# Altium schematic sheet P09-USB_JTAG.SchDoc
size 513 x 386 mm
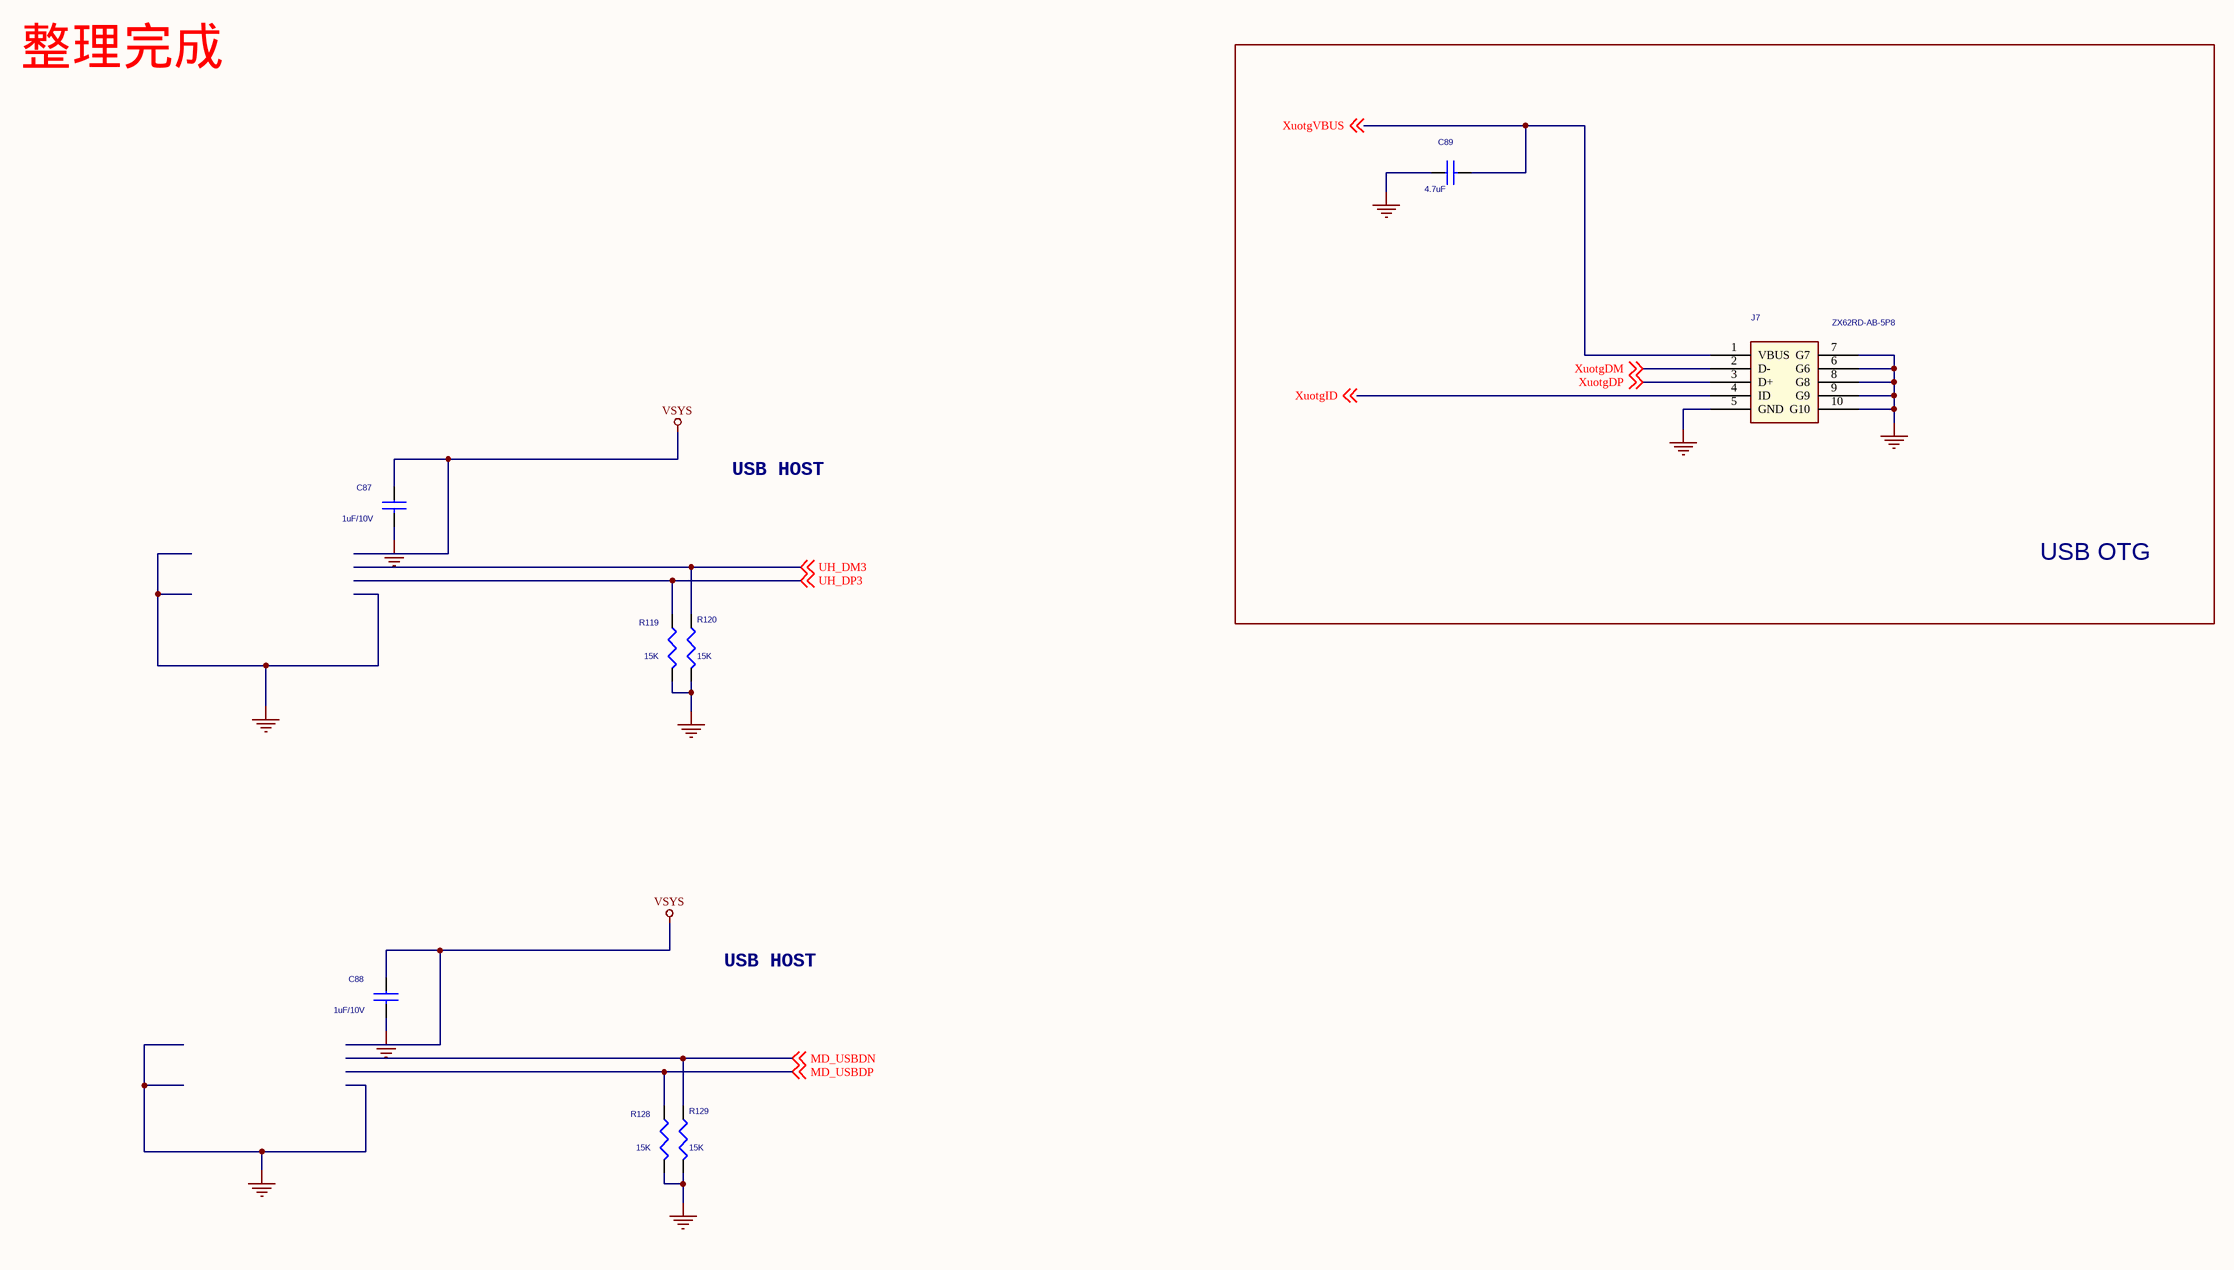
[diagram p0: P09-USB_JTAG.SchDoc]

## Parts
C87  1uF/10V  [C0603-S]
C88  1uF/10V  [C0603-S]
C89  4.7uF  [C0603-S]
J7  ZX62RD-AB-5P8  [MICRO-USB]
R119  15K  [R0603-S]
R120  15K  [R0603-S]
R128  15K  [R0603-S]
R129  15K  [R0603-S]

## Blocks framed on the sheet
USB OTG: C89 J7

## Nets
GND: C87.2 C88.2 C89.1 J7.5(GND) J7.6(G6) J7.7(G7) J7.8(G8) J7.9(G9) J7.10(G10) R119.1 R120.1 R128.1 R129.1
VSYS: C87.1 C88.1
MD_USBDN: R129.2 ; off-sheet MD_USBDN
MD_USBDP: R128.2 ; off-sheet MD_USBDP
UH_DM3: R120.2 ; off-sheet UH_DM3
UH_DP3: R119.2 ; off-sheet UH_DP3
XuotgDM: J7.2(D-) ; off-sheet XuotgDM
XuotgDP: J7.3(D+) ; off-sheet XuotgDP
XuotgID: J7.4(ID) ; off-sheet XuotgID
XuotgVBUS: C89.2 J7.1(VBUS) ; off-sheet XuotgVBUS

## Notes on the sheet
- 整理完成
- USB HOST

## Library data of the parts
C87 C88 = C0603_0
C89 = C1005
J7 = ZX62RD-AB-5P8_3
R119 R120 R128 R129 = R1005_0